# EAGLE schematic Protein (EAGLE 6.3)

## Sheet 1 of 2
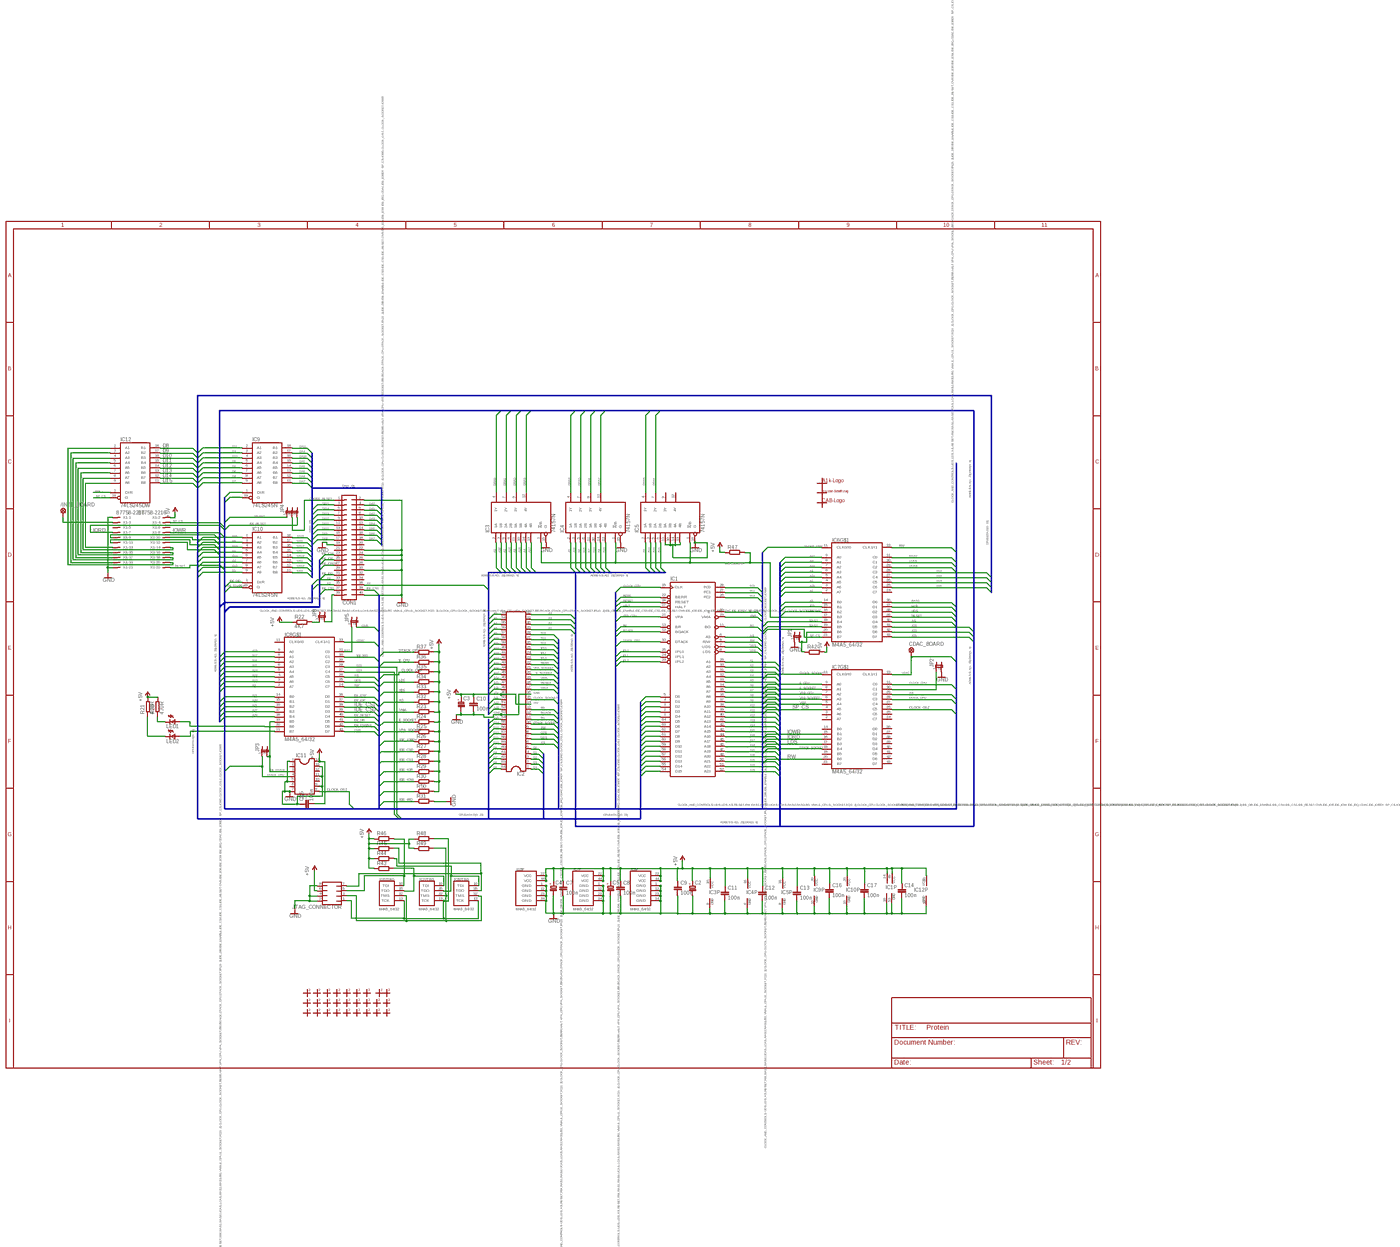
[diagram p0: schematic, sheet 1, overview]
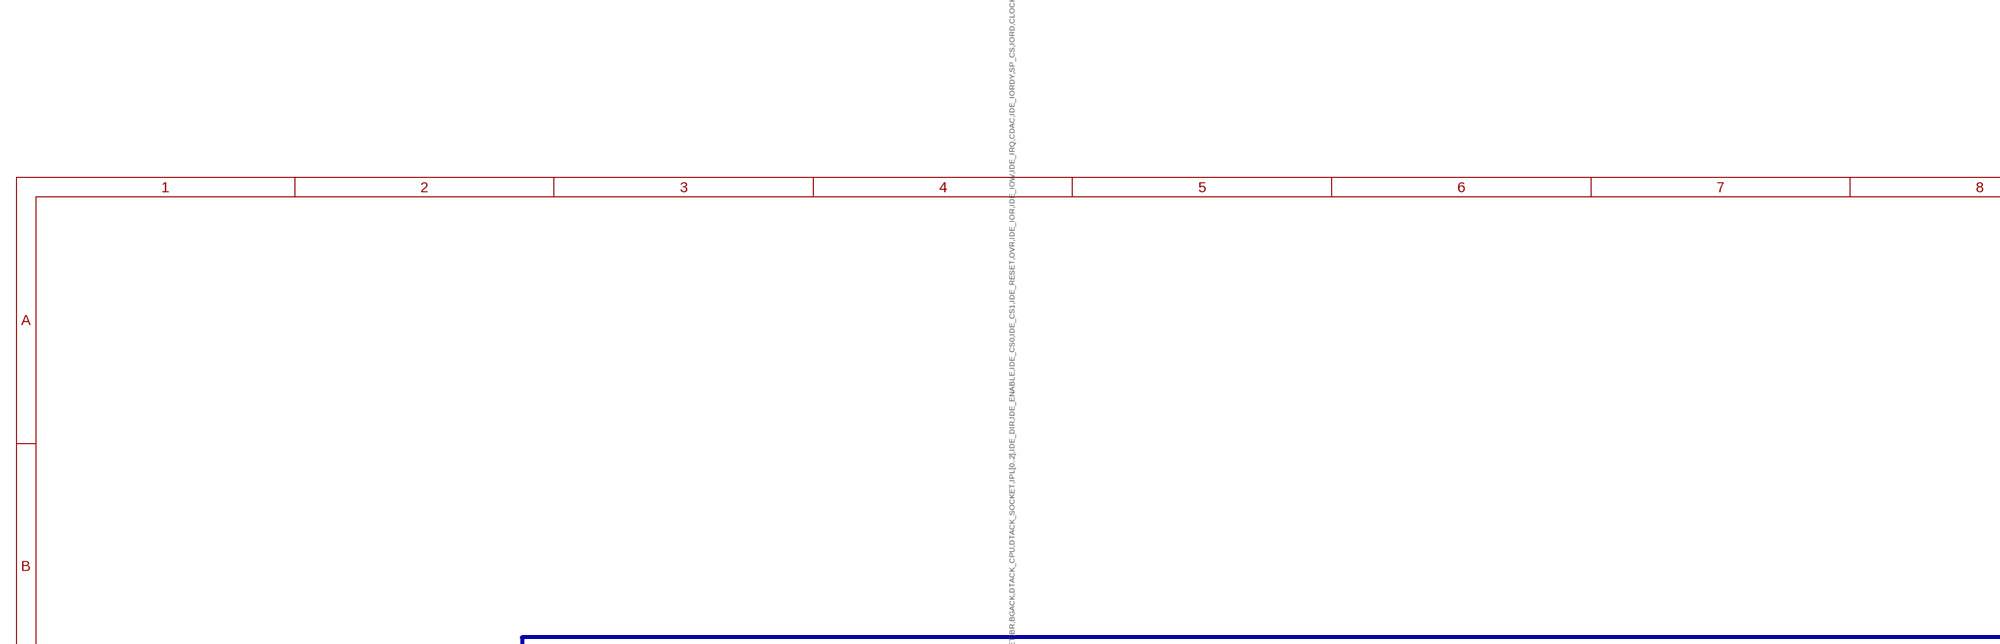
[diagram p1: schematic, sheet 1, part 1 of 4]
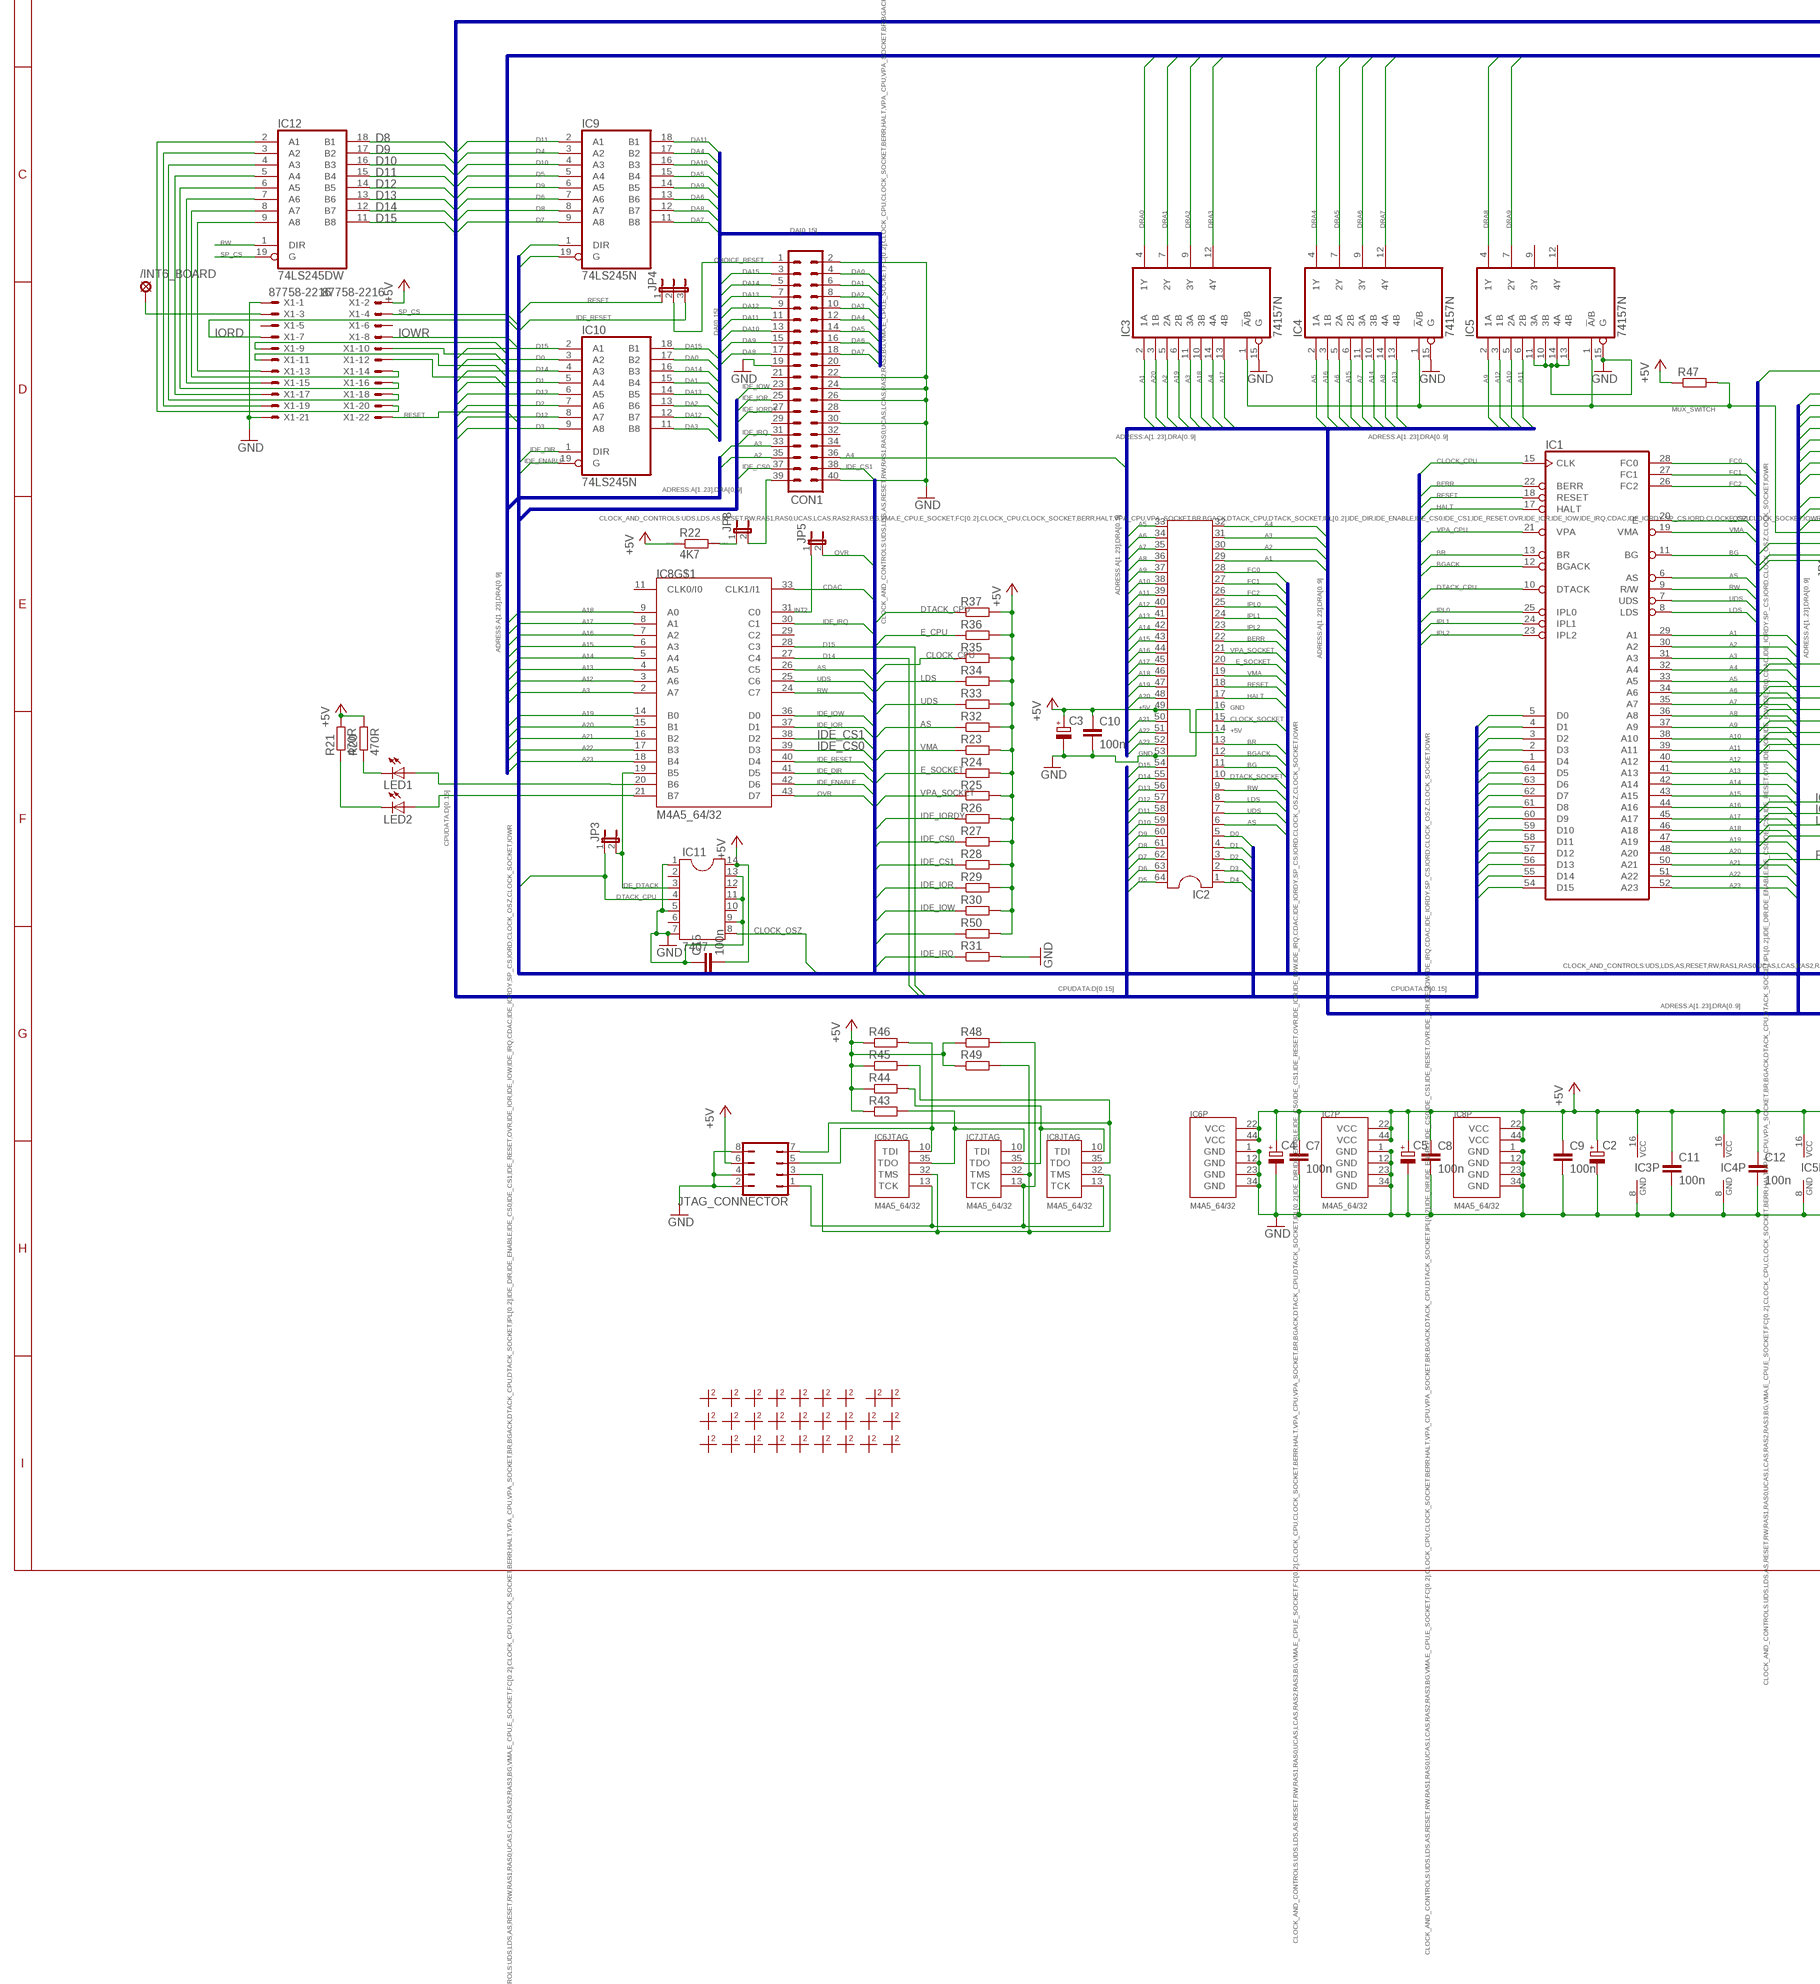
[diagram p2: schematic, sheet 1, part 2 of 4]
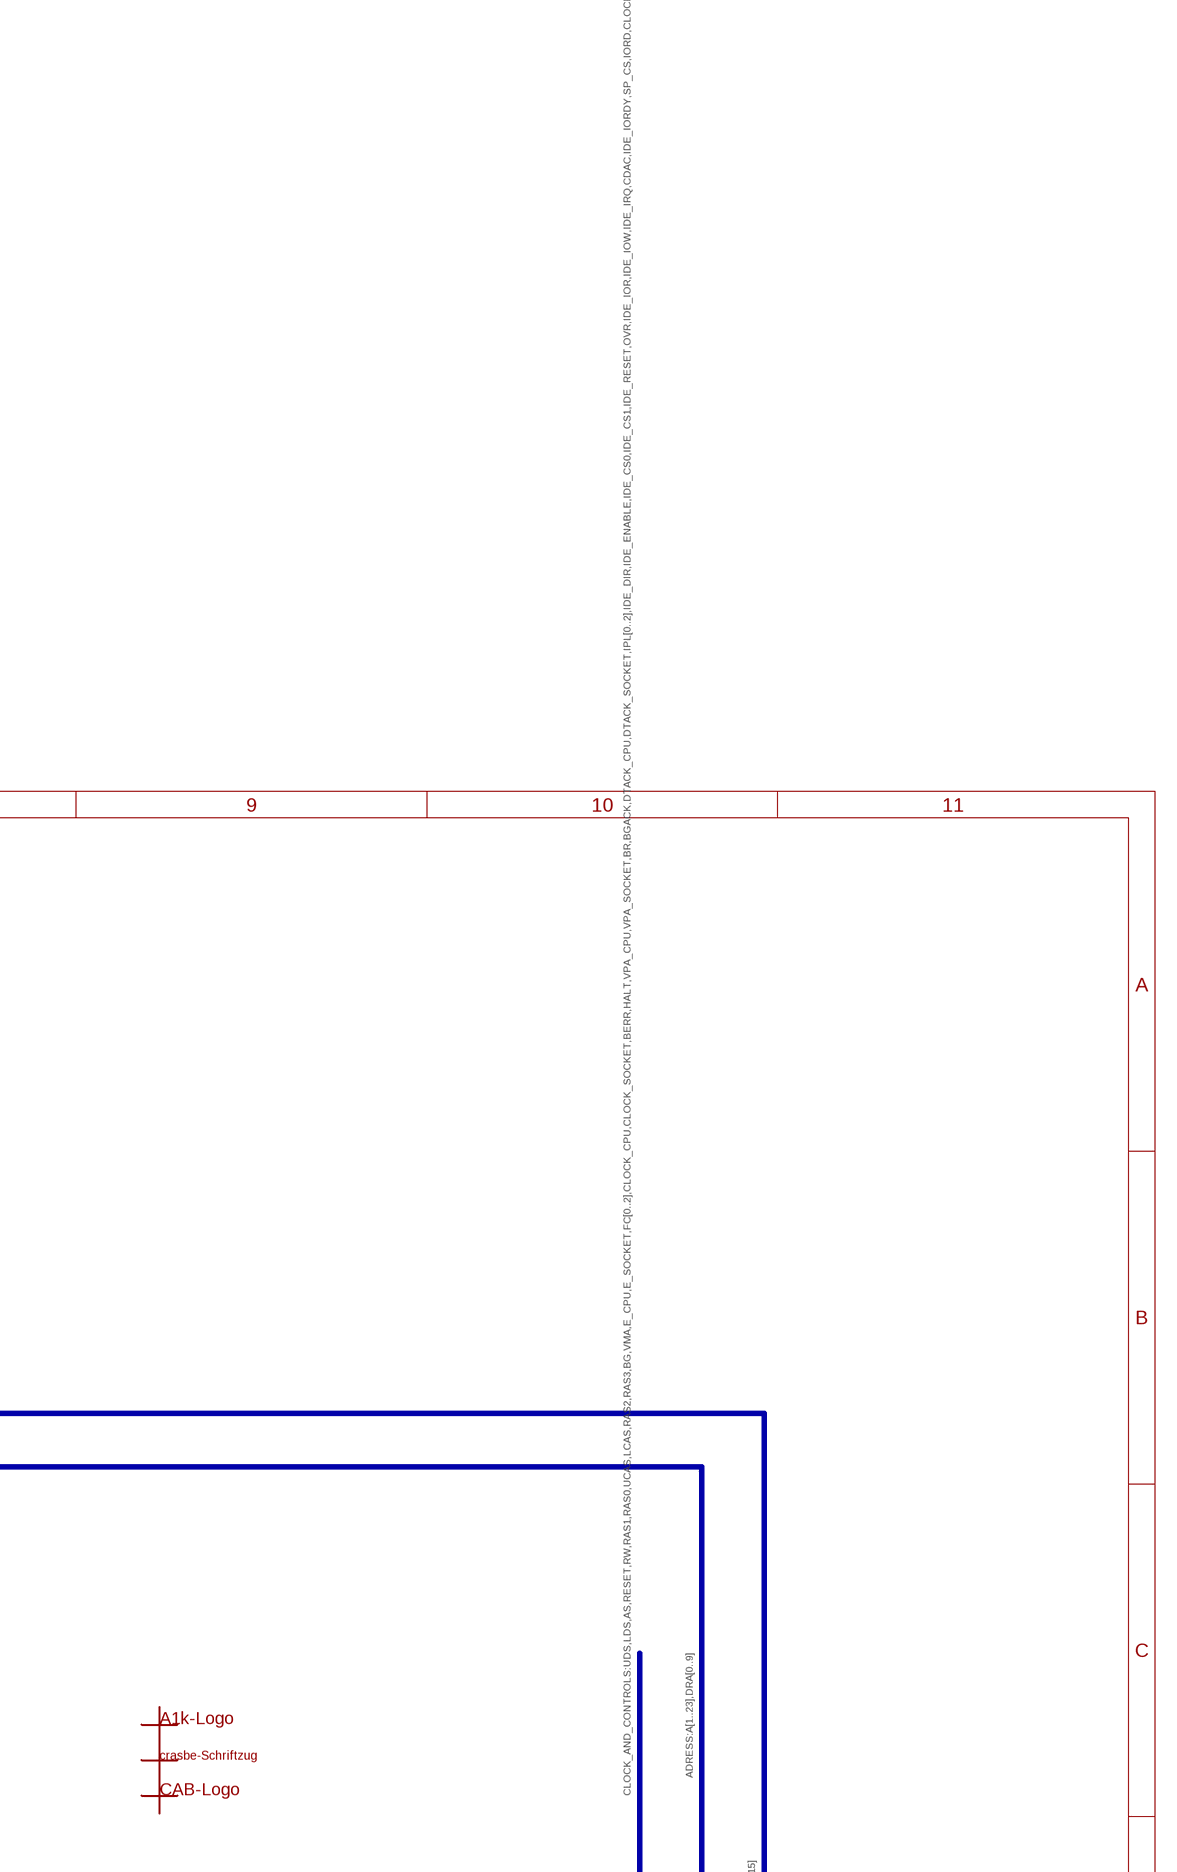
[diagram p3: schematic, sheet 1, part 3 of 4]
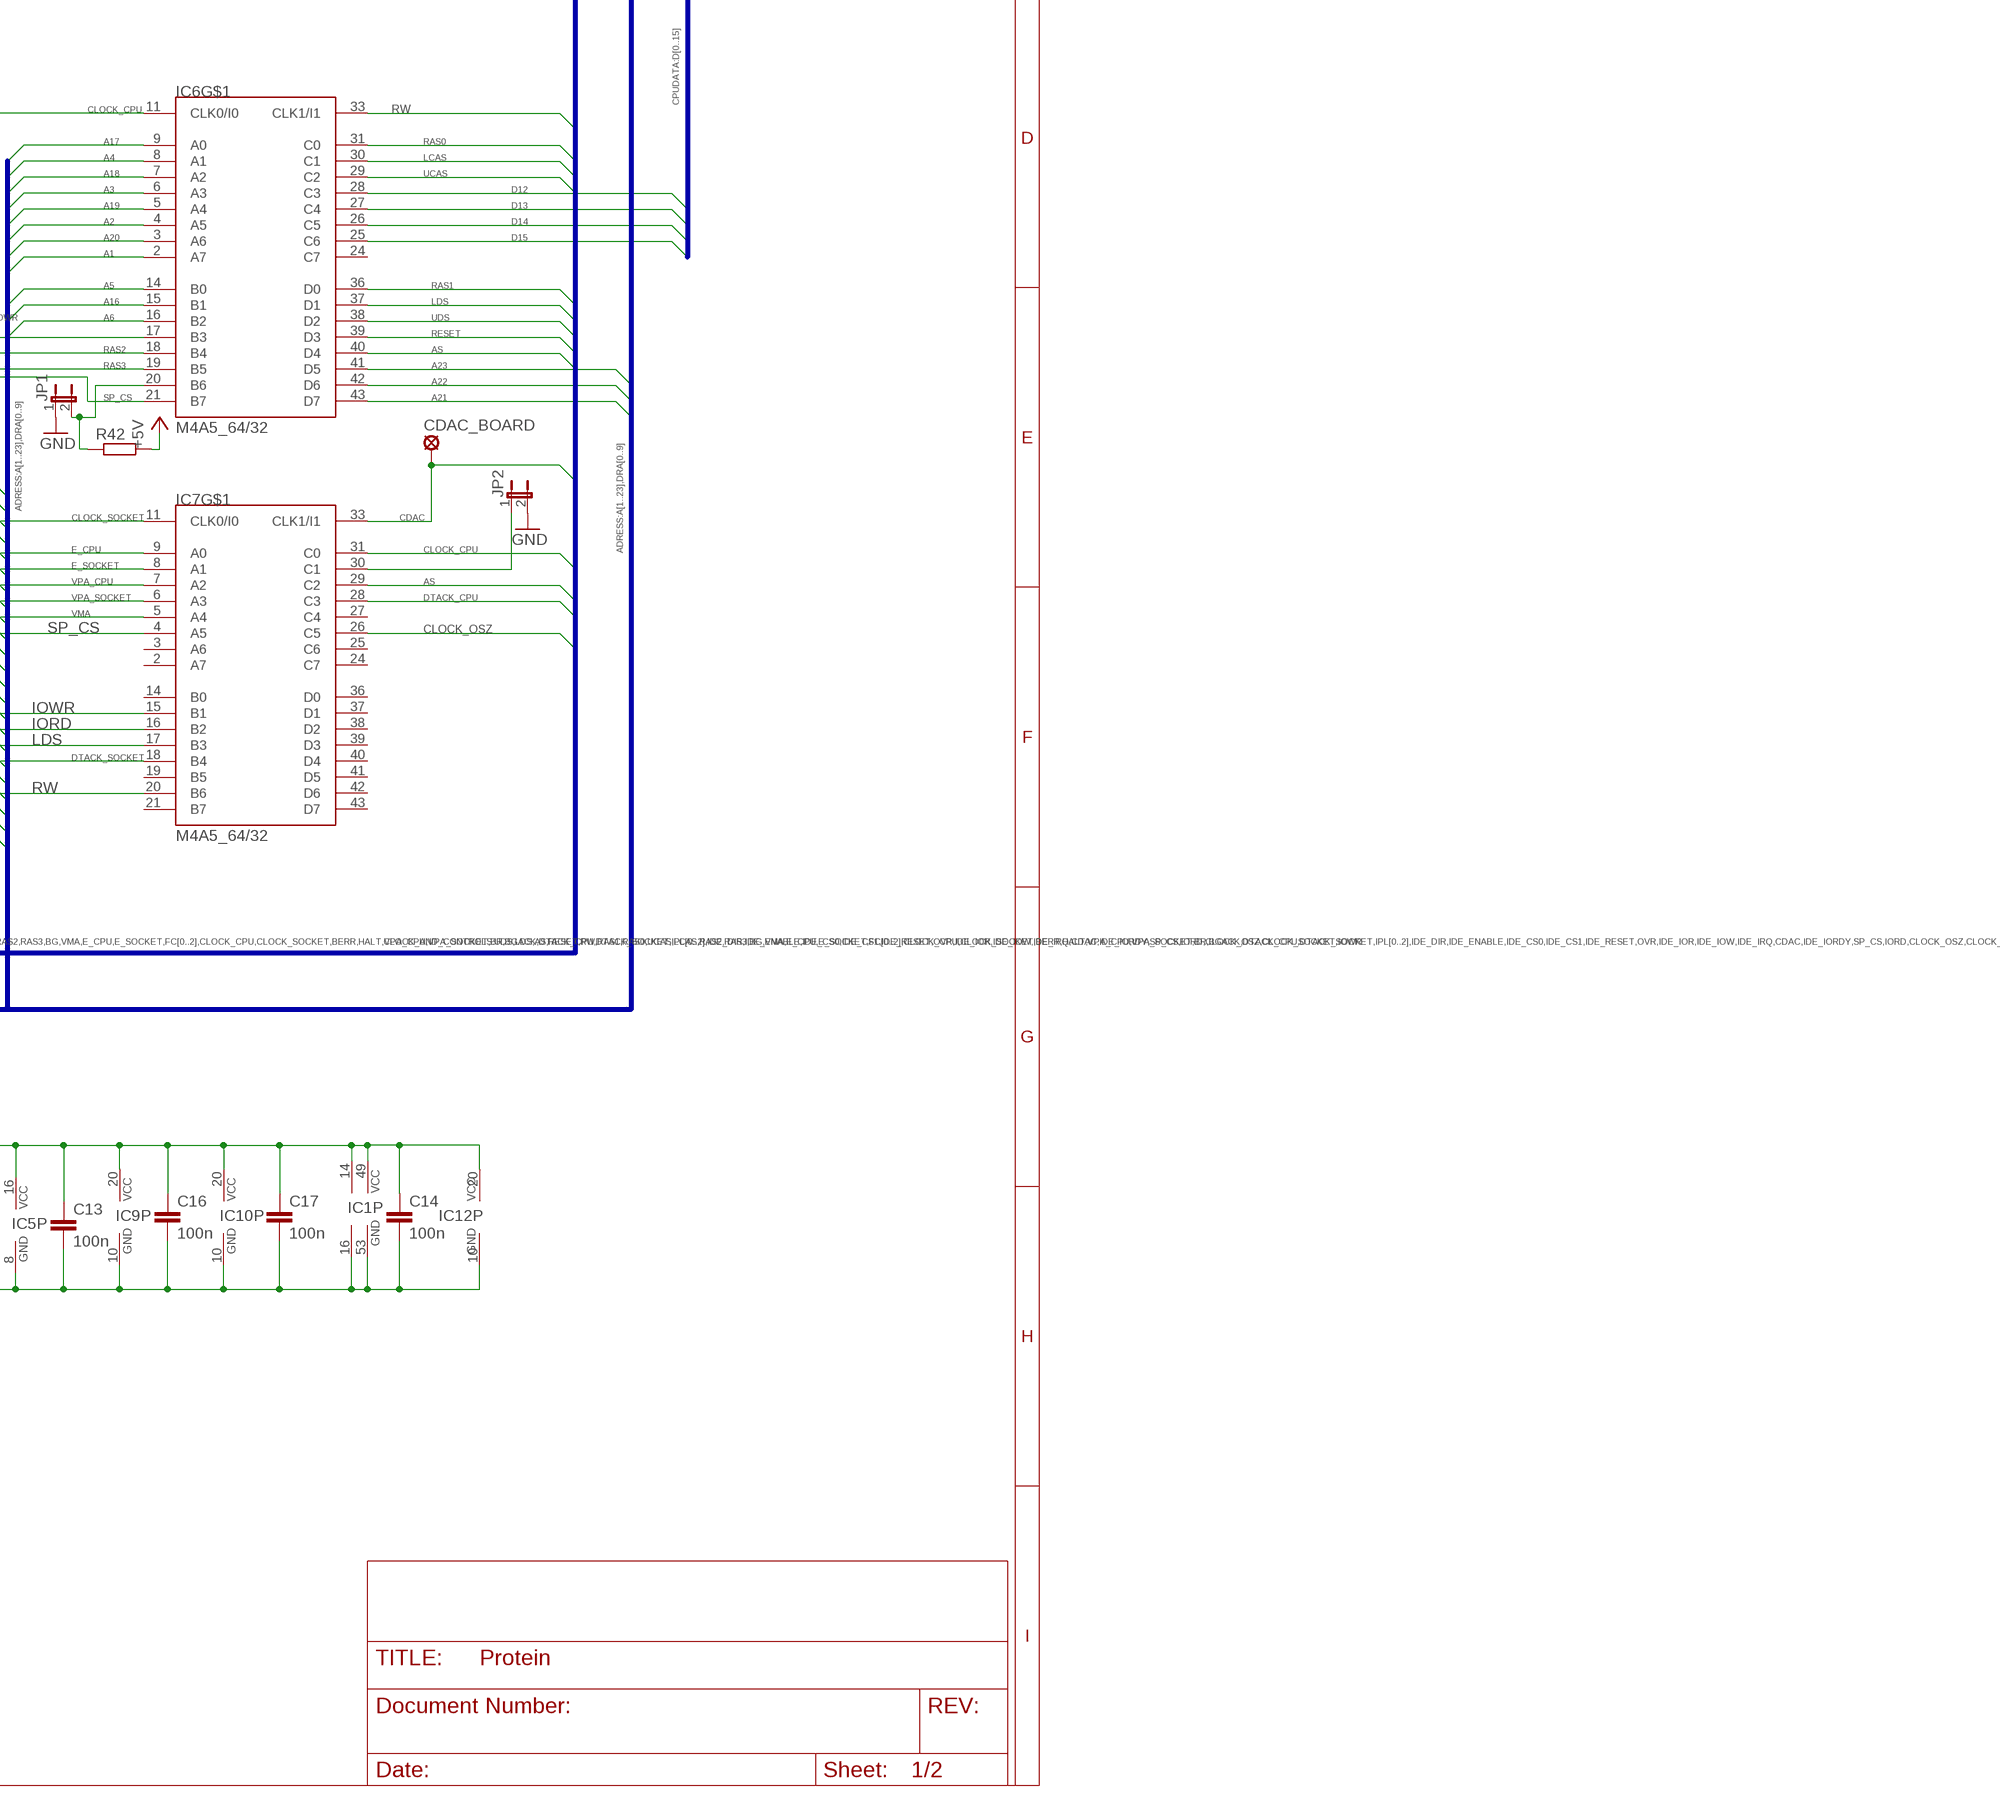
[diagram p4: schematic, sheet 1, part 4 of 4]

### Parts
/INT6_BOARD  SE11  [SE11]
C2  CPOL-EUE2.5-7  [E2,5-7]
C3  CPOL-EUE2.5-7  [E2,5-7]
C4  CPOL-EUE2.5-7  [E2,5-7]
C5  CPOL-EUE2.5-7  [E2,5-7]
C7  100n  C-EU025-024X044  [C025-024X044]
C8  100n  C-EU025-024X044  [C025-024X044]
C9  100n  C-EU025-024X044  [C025-024X044]
C10  100n  C-EU025-024X044  [C025-024X044]
C11  100n  C-EU025-024X044  [C025-024X044]
C12  100n  C-EU025-024X044  [C025-024X044]
C13  100n  C-EU025-024X044  [C025-024X044]
C14  100n  C-EUC1206K  [C1206K]
C15  100n  C-EU025-024X044  [C025-024X044]
C16  100n  C-EU025-024X044  [C025-024X044]
C17  100n  C-EU025-024X044  [C025-024X044]
CDAC_BOARD  SE11  [SE11]
CON1  ML40  [ML40]
IC1  MC68000P  [DIL64]
IC2  DIL64  [DIL64]
IC3  74157N  [DIL16]
IC4  74157N  [DIL16]
IC5  74157N  [DIL16]
IC6  M4A5_64/32  [PLCC-S44]
IC7  M4A5_64/32  [PLCC-S44]
IC8  M4A5_64/32  [PLCC-S44]
IC9  74LS245N  [DIL20]
IC10  74LS245N  [DIL20]
IC11  7407  DIL14  [DIL14]
IC12  74LS245DW  [SO20W]
JP1  JP1E  [JP1]
JP2  JP1E  [JP1]
JP3  JP1E  [JP1]
JP4  JP2E  [JP2]
JP5  JP1E  [JP1]
JP8  JP1E  [JP1]
JTAG_CONNECTOR  JP4Q  [JP4Q]
LED1  LED3MM  [LED3MM]
LED2  LED3MM  [LED3MM]
R20  470R  R-EU_0207/7  [0207/7]
R21  470R  R-EU_0207/7  [0207/7]
R22  4K7  R0207/10  [0207/10]
R23  R-EU_M0805  [M0805]
R24  R-EU_M0805  [M0805]
R25  R-EU_M0805  [M0805]
R26  R-EU_M0805  [M0805]
R27  R-EU_M0805  [M0805]
R28  R-EU_M0805  [M0805]
R29  R-EU_M0805  [M0805]
R30  R-EU_M0805  [M0805]
R31  R-EU_M0805  [M0805]
R32  R-EU_M0805  [M0805]
R33  R-EU_M0805  [M0805]
R34  R-EU_M0805  [M0805]
R35  R-EU_M0805  [M0805]
R36  R-EU_M0805  [M0805]
R37  R-EU_M0805  [M0805]
R42  R-EU_M0805  [M0805]
R43  R-EU_M0805  [M0805]
R44  R-EU_M0805  [M0805]
R45  R-EU_M0805  [M0805]
R46  R-EU_M0805  [M0805]
R47  R-EU_M0805  [M0805]
R48  R-EU_M0805  [M0805]
R49  R-EU_M0805  [M0805]
R50  R-EU_M0805  [M0805]
U$1  A1K  [A1K]
U$2  CRASBE  [CRASBE]
U$3  CAB  [CAB-LOGO]
U$4  BREAD_2  [BREAD]
U$5  BREAD_2  [BREAD]
U$6  BREAD_2  [BREAD]
U$7  BREAD_2  [BREAD]
U$8  BREAD_2  [BREAD]
U$9  BREAD_2  [BREAD]
U$10  BREAD_2  [BREAD]
U$11  BREAD_2  [BREAD]
U$12  BREAD_2  [BREAD]
U$13  BREAD_2  [BREAD]
U$14  BREAD_2  [BREAD]
U$15  BREAD_2  [BREAD]
U$16  BREAD_2  [BREAD]
U$17  BREAD_2  [BREAD]
U$18  BREAD_2  [BREAD]
U$19  BREAD_2  [BREAD]
U$20  BREAD_2  [BREAD]
U$21  BREAD_2  [BREAD]
U$22  BREAD_2  [BREAD]
U$23  BREAD_2  [BREAD]
U$24  BREAD_2  [BREAD]
U$25  BREAD_2  [BREAD]
U$26  BREAD_2  [BREAD]
U$27  BREAD_2  [BREAD]
U$28  BREAD_2  [BREAD]
U$29  BREAD_2  [BREAD]
U$30  BREAD_2  [BREAD]
X1  87758-2216  [87758-2216]

### Nets
+5V: C2.+ C3.+ C4.+ C5.+ C7.1 C8.1 C9.1 C10.1 C11.1 C12.1 C13.1 C14.1 C15.2 C16.1 C17.1 IC1.14(VCC) IC1.49(VCC) IC2.14 IC2.49 IC3.16(VCC) IC4.16(VCC) IC5.16(VCC) IC6.22(P:VCC) IC6.44(P:VCC) IC7.22(P:VCC) IC7.44(P:VCC) IC8.22(P:VCC) IC8.44(P:VCC) IC9.20(VCC) IC10.20(VCC) IC11.14 IC12.20(VCC) JTAG_CONNECTOR.6 R20.2 R21.2 R22.1 R23.2 R24.2 R25.2 R26.2 R27.2 R28.2 R29.2 R30.2 R32.2 R33.2 R34.2 R35.2 R36.2 R37.2 R42.2 R43.1 R44.1 R45.1 R46.1 R47.1 R48.1 R49.1 R50.2 X1.2 ; also sheet 2
A1: IC1.29(A1) IC2.29 IC3.2(1A) IC6.2(A7)
A2: CON1.35 IC1.30(A2) IC2.30 IC3.5(2A) IC6.4(A5) X1.12
A3: CON1.33 IC1.31(A3) IC2.31 IC3.11(3A) IC6.6(A3) IC8.2(A7) X1.11
A4: CON1.36 IC1.32(A4) IC2.32 IC3.14(4A) IC6.8(A1) X1.10
A5: IC1.33(A5) IC2.33 IC4.2(1A) IC6.14(B0) X1.9
A6: IC1.34(A6) IC2.34 IC4.5(2A) IC6.16(B2)
A7: IC1.35(A7) IC2.35 IC4.11(3A)
A8: IC1.36(A8) IC2.36 IC4.14(4A)
A9: IC1.37(A9) IC2.37 IC5.2(1A)
A10: IC1.38(A10) IC2.38 IC5.5(2A)
A11: IC1.39(A11) IC2.39 IC5.6(2B)
A12: IC1.40(A12) IC2.40 IC5.3(1B) IC8.3(A6)
A13: IC1.41(A13) IC2.41 IC4.13(4B) IC8.4(A5)
A14: IC1.42(A14) IC2.42 IC4.10(3B) IC8.5(A4)
A15: IC1.43(A15) IC2.43 IC4.6(2B) IC8.6(A3)
A16: IC1.44(A16) IC2.44 IC4.3(1B) IC6.15(B1) IC8.7(A2)
A17: IC1.45(A17) IC2.45 IC3.13(4B) IC6.9(A0) IC8.8(A1)
A18: IC1.46(A18) IC2.46 IC3.10(3B) IC6.7(A2) IC8.9(A0)
A19: IC1.47(A19) IC2.47 IC3.6(2B) IC6.5(A4) IC8.14(B0)
A20: IC1.48(A20) IC2.48 IC3.3(1B) IC6.3(A6) IC8.15(B1)
A21: IC1.50(A21) IC2.50 IC6.43(D7) IC8.16(B2)
A22: IC1.51(A22) IC2.51 IC6.42(D6) IC8.17(B3)
A23: IC1.52(A23) IC2.52 IC6.41(D5) IC8.18(B4)
AS: IC1.6(AS) IC2.6 IC6.40(D4) IC7.29(C2) IC8.26(C5) R32.1
BERR: IC1.22(BERR) IC2.22
BG: IC1.11(BG) IC2.11
BGACK: IC1.12(BGACK) IC2.12
BR: IC1.13(BR) IC2.13
CDAC: CDAC_BOARD.MP IC7.33(CLK1/I1) IC8.33(CLK1/I1)
CHOICE_RESET: CON1.1 JP4.2
CLOCK_CPU: IC1.15(CLK) IC6.11(CLK0/I0) IC7.31(C0) R35.1
CLOCK_OSZ: IC7.26(C5) IC11.8
CLOCK_SOCKET: IC2.15 IC7.11(CLK0/I0)
D0: IC1.5(D0) IC2.5 IC10.3(A2) ; also sheet 2
D1: IC1.4(D1) IC2.4 IC10.5(A4) ; also sheet 2
D2: IC1.3(D2) IC2.3 IC10.7(A6) ; also sheet 2
D3: IC1.2(D3) IC2.2 IC10.9(A8) ; also sheet 2
D4: IC1.1(D4) IC2.1 IC9.3(A2) ; also sheet 2
D5: IC1.64(D5) IC2.64 IC9.5(A4) ; also sheet 2
D6: IC1.63(D6) IC2.63 IC9.7(A6) ; also sheet 2
D7: IC1.62(D7) IC2.62 IC9.9(A8) ; also sheet 2
D8: IC1.61(D8) IC2.61 IC9.8(A7) IC12.18(B1) ; also sheet 2
D9: IC1.60(D9) IC2.60 IC9.6(A5) IC12.17(B2) ; also sheet 2
D10: IC1.59(D10) IC2.59 IC9.4(A3) IC12.16(B3) ; also sheet 2
D11: IC1.58(D11) IC2.58 IC9.2(A1) IC12.15(B4) ; also sheet 2
D12: IC1.57(D12) IC2.57 IC6.28(C3) IC10.8(A7) IC12.14(B5) ; also sheet 2
D13: IC1.56(D13) IC2.56 IC6.27(C4) IC10.6(A5) IC12.13(B6) ; also sheet 2
D14: IC1.55(D14) IC2.55 IC6.26(C5) IC8.27(C4) IC10.4(A3) IC12.12(B7) ; also sheet 2
D15: IC1.54(D15) IC2.54 IC6.25(C6) IC8.28(C3) IC10.2(A1) IC12.11(B8) ; also sheet 2
DA0: CON1.4 IC10.17(B2)
DA1: CON1.6 IC10.15(B4)
DA2: CON1.8 IC10.13(B6)
DA3: CON1.10 IC10.11(B8)
DA4: CON1.12 IC9.17(B2)
DA5: CON1.14 IC9.15(B4)
DA6: CON1.16 IC9.13(B6)
DA7: CON1.18 IC9.11(B8)
DA8: CON1.17 IC9.12(B7)
DA9: CON1.15 IC9.14(B5)
DA10: CON1.13 IC9.16(B3)
DA11: CON1.11 IC9.18(B1)
DA12: CON1.9 IC10.12(B7)
DA13: CON1.7 IC10.14(B5)
DA14: CON1.5 IC10.16(B3)
DA15: CON1.3 IC10.18(B1)
DRA0: IC3.4(1Y) ; also sheet 2
DRA1: IC3.7(2Y) ; also sheet 2
DRA2: IC3.9(3Y) ; also sheet 2
DRA3: IC3.12(4Y) ; also sheet 2
DRA4: IC4.4(1Y) ; also sheet 2
DRA5: IC4.7(2Y) ; also sheet 2
DRA6: IC4.9(3Y) ; also sheet 2
DRA7: IC4.12(4Y) ; also sheet 2
DRA8: IC5.4(1Y) ; also sheet 2
DRA9: IC5.7(2Y) ; also sheet 2
DTACK_CPU: IC1.10(DTACK) IC7.28(C3) IC11.4 JP3.1 R37.1
DTACK_SOCKET: IC2.10 IC7.18(B4)
E_CPU: IC1.20(E) IC7.9(A0) R36.1
E_SOCKET: IC2.20 IC7.8(A1) R24.1
FC0: IC1.28(FC0) IC2.28
FC1: IC1.27(FC1) IC2.27
FC2: IC1.26(FC2) IC2.26
GND: C2.- C3.- C4.- C5.- C7.2 C8.2 C9.2 C10.2 C11.2 C12.2 C13.2 C14.2 C15.1 C16.2 C17.2 CON1.2 CON1.19 CON1.22 CON1.24 CON1.26 CON1.30 CON1.40 IC1.16(GND) IC1.53(GND) IC2.16 IC2.53 IC3.8(GND) IC3.15(G) IC4.8(GND) IC4.15(G) IC5.8(GND) IC5.10(3B) IC5.11(3A) IC5.13(4B) IC5.14(4A) IC5.15(G) IC6.1(P:GND) IC6.12(P:GND) IC6.23(P:GND) IC6.34(P:GND) IC7.1(P:GND) IC7.12(P:GND) IC7.23(P:GND) IC7.34(P:GND) IC8.1(P:GND) IC8.12(P:GND) IC8.23(P:GND) IC8.34(P:GND) IC9.10(GND) IC10.10(GND) IC11.1 IC11.5 IC11.7 IC11.9 IC11.11 IC11.13 IC12.10(GND) JP1.1 JP2.2 JTAG_CONNECTOR.2 JTAG_CONNECTOR.4 JTAG_CONNECTOR.8 R31.2 X1.1 X1.21 ; also sheet 2
HALT: IC1.17(HALT) IC2.17
IDE_CS0: CON1.37 IC8.39(D3) R27.1
IDE_CS1: CON1.38 IC8.38(D2) R28.1
IDE_DIR: IC8.41(D5) IC9.1(DIR) IC10.1(DIR)
IDE_DTACK: IC8.19(B5) IC11.3 JP3.2
IDE_ENABLE: IC8.42(D6) IC9.19(G) IC10.19(G)
IDE_IOR: CON1.25 IC8.37(D1) R29.1
IDE_IORDY: CON1.27 R26.1
IDE_IOW: CON1.23 IC8.36(D0) R30.1
IDE_IRQ: CON1.31 IC8.30(C1) R31.1
IDE_RESET: IC8.40(D4) JP4.3
INT2: IC8.31(C0) JP5.1
IORD: IC7.16(B2) X1.7
IOWR: IC7.15(B1) X1.8
IPL0: IC1.25(IPL0) IC2.25
IPL1: IC1.24(IPL1) IC2.24
IPL2: IC1.23(IPL2) IC2.23
LCAS: IC6.30(C1) ; also sheet 2
LDS: IC1.8(LDS) IC2.8 IC6.37(D1) IC7.17(B3) R34.1
MUX_SWITCH: IC3.1(!A!/B) IC4.1(!A!/B) IC5.1(!A!/B) IC6.17(B3) R47.2
N$1: IC6.20(B6) JP1.2 R42.1
N$2: IC8.21(B7) LED2.A
N$3: IC8.20(B6) LED1.A
N$4: IC7.30(C1) JP2.1
N$5: JP8.1 R22.2
N$10: CON1.39 JP8.2
N$11: IC6.13(JTAG:TCK) IC7.13(JTAG:TCK) IC8.13(JTAG:TCK) JTAG_CONNECTOR.1 R48.2
N$12: IC6.32(JTAG:TMS) IC7.32(JTAG:TMS) IC8.32(JTAG:TMS) JTAG_CONNECTOR.3 R49.2
N$13: IC6.35(JTAG:TDO) IC7.10(JTAG:TDI) R43.2
N$14: IC7.35(JTAG:TDO) IC8.10(JTAG:TDI) R44.2
N$15: /INT6_BOARD.MP X1.3
N$16: IC6.10(JTAG:TDI) JTAG_CONNECTOR.5 R46.2
N$17: IC8.35(JTAG:TDO) JTAG_CONNECTOR.7 R45.2
N$18: IC12.8(A7) X1.14
N$20: IC12.9(A8) X1.13
N$22: IC12.7(A6) X1.15
N$23: IC12.6(A5) X1.16
N$25: IC12.5(A4) X1.17
N$26: IC12.4(A3) X1.18
N$27: IC12.3(A2) X1.19
N$29: IC12.2(A1) X1.20
N$31: LED1.K(C) R20.1
N$32: LED2.K(C) R21.1
OVR: IC8.43(D7) JP5.2
RAS0: IC6.31(C0) ; also sheet 2
RAS1: IC6.36(D0) ; also sheet 2
RAS2: IC6.18(B4) ; also sheet 2
RAS3: IC6.19(B5) ; also sheet 2
RESET: IC1.18(RESET) IC2.18 IC6.39(D3) JP4.1 R50.1 X1.22
RW: IC1.9(R/W) IC2.9 IC6.33(CLK1/I1) IC7.20(B6) IC8.24(C7) IC12.1(DIR) ; also sheet 2
SP_CS: IC6.21(B7) IC7.4(A5) IC12.19(G) X1.4
UCAS: IC6.29(C2) ; also sheet 2
UDS: IC1.7(UDS) IC2.7 IC6.38(D2) IC8.25(C6) R33.1
VMA: IC1.19(VMA) IC2.19 IC7.5(A4) R23.1
VPA_CPU: IC1.21(VPA) IC7.7(A2)
VPA_SOCKET: IC2.21 IC7.6(A3) R25.1
Unconnected: CON1.20 CON1.21 CON1.28 CON1.29 CON1.32 CON1.34 IC5.9(3Y) IC5.12(4Y) IC6.24(C7) IC7.2(A7) IC7.3(A6) IC7.14(B0) IC7.19(B5) IC7.21(B7) IC7.24(C7) IC7.25(C6) IC7.27(C4) IC7.36(D0) IC7.37(D1) IC7.38(D2) IC7.39(D3) IC7.40(D4) IC7.41(D5) IC7.42(D6) IC7.43(D7) IC8.11(CLK0/I0) IC8.29(C2) IC11.2 IC11.6 IC11.10 IC11.12 X1.5 X1.6

### Buses
ADRESS:A[1..23],DRA[0..9]
CPUDATA:D[0..15]
CLOCK_AND_CONTROLS:UDS,LDS,AS,RESET,RW,RAS1,RAS0,UCAS,LCAS,RAS2,RAS3,BG,VMA,E_CPU,E_SOCKET,FC[0..2],CLOCK_CPU,CLOCK_SOCKET,BERR,HALT,VPA_CPU,VPA_SOCKET,BR,BGACK,DTACK_CPU,DTACK_SOCKET,IPL[0..2],IDE_DIR,IDE_ENABLE,IDE_CS0,IDE_CS1,IDE_RESET,OVR,IDE_IOR,IDE_IOW,IDE_IRQ,CDAC,IDE_IORDY,SP_CS,IORD,CLOCK_OSZ,CLOCK_SOCKET,IOWR
DA[0..15]

## Sheet 2 of 2
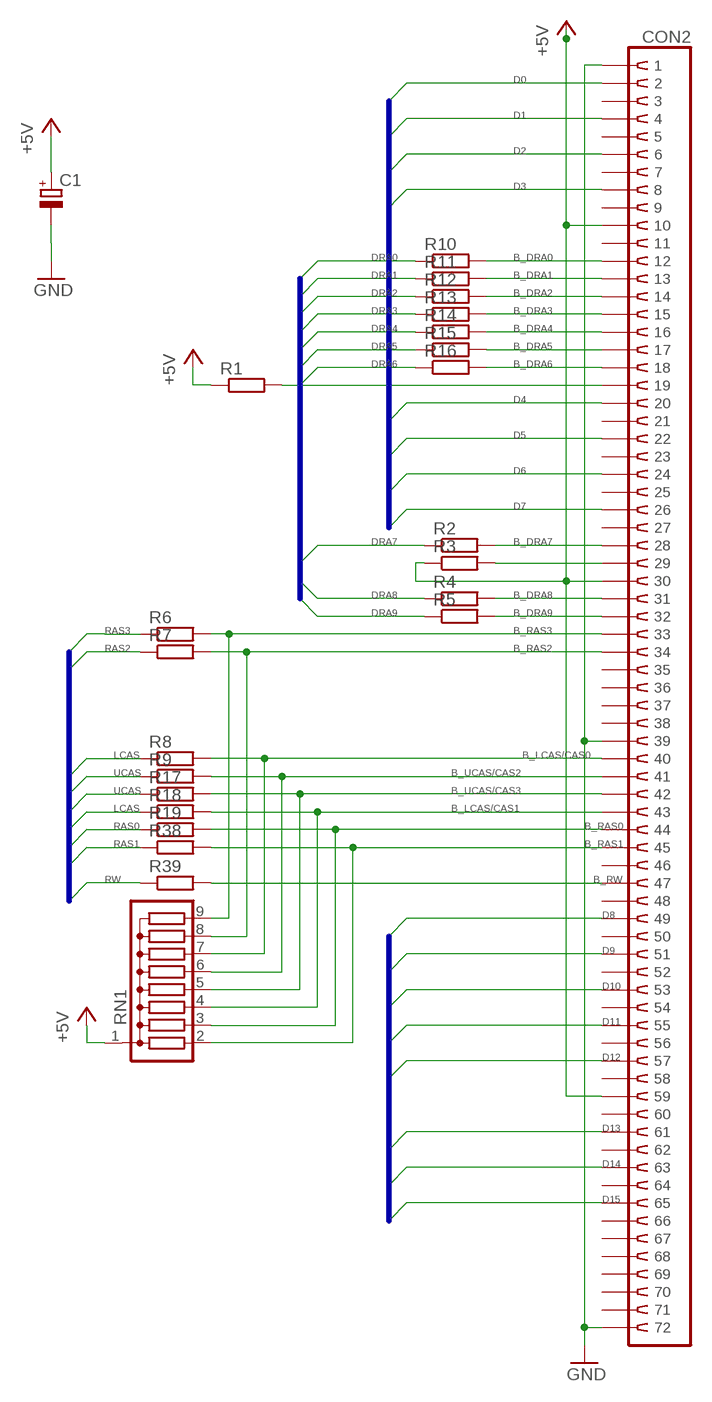
[diagram p5: schematic, sheet 2]

### Parts
C1  CPOL-EUE1.8-4  [E1,8-4]
CON2  SIMM72  [73826962]
R1  R-EU_M0805  [M0805]
R2  R-EU_0207/7  [0207/7]
R3  R-EU_0207/7  [0207/7]
R4  R-EU_0207/7  [0207/7]
R5  R-EU_0207/7  [0207/7]
R6  R-EU_0207/7  [0207/7]
R7  R-EU_0207/7  [0207/7]
R8  R-EU_0207/7  [0207/7]
R9  R-EU_0207/7  [0207/7]
R10  R-EU_0207/7  [0207/7]
R11  R-EU_0207/7  [0207/7]
R12  R-EU_0207/7  [0207/7]
R13  R-EU_0207/7  [0207/7]
R14  R-EU_0207/7  [0207/7]
R15  R-EU_0207/7  [0207/7]
R16  R-EU_0207/7  [0207/7]
R17  R-EU_0207/7  [0207/7]
R18  R-EU_0207/7  [0207/7]
R19  R-EU_0207/7  [0207/7]
R38  R-EU_0207/7  [0207/7]
R39  R-EU_0207/7  [0207/7]
RN1  G08R  [SIL9]

### Nets
+5V: C1.+ CON2.10 CON2.30 CON2.59 R1.1 R3.1 RN1.1 ; also sheet 1
B_DRA0: CON2.12 R10.2
B_DRA1: CON2.13 R11.2
B_DRA2: CON2.14 R12.2
B_DRA3: CON2.15 R13.2
B_DRA4: CON2.16 R14.2
B_DRA5: CON2.17 R15.2
B_DRA6: CON2.18 R16.2
B_DRA7: CON2.28 R2.2
B_DRA8: CON2.31 R4.2
B_DRA9: CON2.32 R5.2
B_LCAS/CAS0: CON2.40 R8.2 RN1.7
B_LCAS/CAS1: CON2.43 R18.2 RN1.4
B_RAS0: CON2.44 R19.2 RN1.3
B_RAS1: CON2.45 R38.2 RN1.2
B_RAS2: CON2.34 R7.2 RN1.8
B_RAS3: CON2.33 R6.2 RN1.9
B_RW: CON2.47 R39.2
B_UCAS/CAS2: CON2.41 R9.2 RN1.6
B_UCAS/CAS3: CON2.42 R17.2 RN1.5
D0: CON2.2 ; also sheet 1
D1: CON2.4 ; also sheet 1
D2: CON2.6 ; also sheet 1
D3: CON2.8 ; also sheet 1
D4: CON2.20 ; also sheet 1
D5: CON2.22 ; also sheet 1
D6: CON2.24 ; also sheet 1
D7: CON2.26 ; also sheet 1
D8: CON2.49 ; also sheet 1
D9: CON2.51 ; also sheet 1
D10: CON2.53 ; also sheet 1
D11: CON2.55 ; also sheet 1
D12: CON2.57 ; also sheet 1
D13: CON2.61 ; also sheet 1
D14: CON2.63 ; also sheet 1
D15: CON2.65 ; also sheet 1
DRA0: R10.1 ; also sheet 1
DRA1: R11.1 ; also sheet 1
DRA2: R12.1 ; also sheet 1
DRA3: R13.1 ; also sheet 1
DRA4: R14.1 ; also sheet 1
DRA5: R15.1 ; also sheet 1
DRA6: R16.1 ; also sheet 1
DRA7: R2.1 ; also sheet 1
DRA8: R4.1 ; also sheet 1
DRA9: R5.1 ; also sheet 1
GND: C1.- CON2.1 CON2.39 CON2.72 ; also sheet 1
LCAS: R8.1 R18.1 ; also sheet 1
N$33: CON2.19 R1.2
N$34: CON2.29 R3.2
RAS0: R19.1 ; also sheet 1
RAS1: R38.1 ; also sheet 1
RAS2: R7.1 ; also sheet 1
RAS3: R6.1 ; also sheet 1
RW: R39.1 ; also sheet 1
UCAS: R9.1 R17.1 ; also sheet 1
Unconnected: CON2.3 CON2.5 CON2.7 CON2.9 CON2.11 CON2.21 CON2.23 CON2.25 CON2.27 CON2.35 CON2.36 CON2.37 CON2.38 CON2.46 CON2.48 CON2.50 CON2.52 CON2.54 CON2.56 CON2.58 CON2.60 CON2.62 CON2.64 CON2.66 CON2.67 CON2.68 CON2.69 CON2.70 CON2.71

### Buses
CPUDATA:D[0..15]
CLOCK_AND_CONTROLS:UDS,LDS,AS,RESET,RW,RAS1,RAS0,UCAS,LCAS,RAS2,RAS3,BG,VMA,E_CPU,E_SOCKET,FC[0..2],CLOCK_CPU,CLOCK_SOCKET,BERR,HALT,VPA_CPU,VPA_SOCKET,BR,BGACK,DTACK_CPU,DTACK_SOCKET,IPL[0..2],IDE_DIR,IDE_ENABLE,IDE_CS0,IDE_CS1,IDE_RESET,OVR,IDE_IOR,IDE_IOW,IDE_IRQ,CDAC,IDE_IORDY,SP_CS,IORD,CLOCK_OSZ,CLOCK_SOCKET
ADRESS:A[1..23],DRA[0..9]

## Library data of the parts
/INT6_BOARD CDAC_BOARD = solpad:SE11: SOLDER PAD RTM, drill 1,1mm, distributor Buerklin, 07F810
C1-C5 = rcl:CPOL-EU: POLARIZED CAPACITOR, European symbol
C7-C17 = rcl:C-EU: CAPACITOR, European symbol
CON1 = con-harting-ml:ML40: HARTING; OC_FARNELL: unknown; OC_NEWARK: unknown
CON2 = con-amp:SIMM72: AMP connector
IC1 = micro-mc68000:MC68000P: 68xxx PROCESSOR; OC_FARNELL: unknown; OC_NEWARK: unknown
IC2 = ic-package:DIL64: Dual In Line
IC3-IC5 = 74xx-eu:74*157: Quadruple 2-line to 1-line data SELECTOR/MULTIPLEXER
IC6-IC8 = protein:M4A5_64/32
IC9 IC10 IC12 = 74xx-eu:74*245: Octal BUS TRANSCEIVER, 3-state
IC11 = ic-package:DIL14: Dual In Line / Socket
JP1-JP3 JP5 JP8 = jumper:JP1E: JUMPER
JP4 = jumper:JP2E: JUMPER
JTAG_CONNECTOR = jumper:JP4Q: JUMPER
LED1 LED2 = led:LED: LED OSRAM: - CHIPLED LG R971, LG N971, LY N971, LG Q971, LY Q971, LO R971, LY R971 LH N974, LH R974 LS Q976, LO Q976, LY Q976 LO Q996 - Hyper CHIPLED LW Q18S LB Q993, LB Q99A, LB R99A - SideLED LS A670, LO A670, LY A670, LG A670, LP A670 LB A673, LV A673, LT A673, LW A673 LH A674 LY A675 LS A676, LA A676, LO A676, LY A676, LW A676 LS A679, LY A679, LG A679 - Hyper Micro SIDELED® LS Y876, LA Y876, LO Y876, LY Y876 LT Y87S - SmartLED LW L88C, LW L88S LB L89C, LB L89S, LG L890 LS L89K, LO L89K, LY L89K LS L896, LA L896, LO L896, LY L896 - TOPLED LS T670, LO T670, LY T670, LG T670, LP T670 LSG T670, LSP T670, LSY T670, LOP T670, LYG T670 LG T671, LOG T671, LSG T671 LB T673, LV T673, LT T673, LW T673 LH T674 LS T676, LA T676, LO T676, LY T676, LB T676, LH T676, LSB T676, LW T676 LB T67C, LV T67C, LT T67C, LS T67K, LO T67K, LY T67K, LW E67C LS E67B, LA E67B, LO E67B, LY E67B, LB E67C, LV E67C, LT E67C LW T67C LS T679, LY T679, LG T679 LS T770, LO T770, LY T770, LG T770, LP T770 LB T773, LV T773, LT T773, LW T773 LH T774 LS E675, LA E675, LY E675, LS T675 LS T776, LA T776, LO T776, LY T776, LB T776 LHGB T686 LT T68C, LB T68C - Hyper Mini TOPLED® LB M676 - Mini TOPLED Santana® LG M470 LS M47K, LO M47K, LY M47K Source: http://www.osram.convergy.de LUXEON: - LUMILED® LXK2-PW12-R00, LXK2-PW12-S00, LXK2-PW14-U00, LXK2-PW14-V00 LXK2-PM12-R00, LXK2-PM12-S00, LXK2-PM14-U00 LXK2-PE12-Q00, LXK2-PE12-R00, LXK2-PE12-S00, LXK2-PE14-T00, LXK2-PE14-U00 LXK2-PB12-K00, LXK2-PB12-L00, LXK2-PB12-M00, LXK2-PB14-N00, LXK2-PB14-P00, LXK2-PB14-Q00 LXK2-PR12-L00, LXK2-PR12-M00, LXK2-PR14-Q00, LXK2-PR14-R00 LXK2-PD12-Q00, LXK2-PD12-R00, LXK2-PD12-S00 LXK2-PH12-R00, LXK2-PH12-S00 LXK2-PL12-P00, LXK2-PL12-Q00, LXK2-PL12-R00 Source: www.luxeon.com KINGBRIGHT: KA-3528ASYC Source: www.kingbright.com
R1-R21 R23-R39 R42-R50 = rcl:R-EU_: RESISTOR, European symbol
R22 = eagle-ltspice:R: RESISTOR, European symbol; SPICEMODEL: NONE; SPICEPREFIX: R
RN1 = resistor-sil:G08R: SIL RESISTOR; OC_FARNELL: unknown; OC_NEWARK: unknown
U$1 = logos:A1K
U$2 = logos:CRASBE
U$3 = logos:CAB
U$4-U$30 = protein:BREAD_2
X1 = con-molex:87758-2216: 22 Pin - 2mm Dual Row Single Wafer, Vertical T/H HDR Source: http://www.molex.com/pdm_docs/sd/877580616_sd.pdf; MPN: 87758-2216; OC_FARNELL: unknown; OC_NEWARK: 94M1536